# Altium schematic sheet 8CH EEG.SchDoc
size B; SheetNumber: 6; SheetTotal: 11; TitleBlk1Sch: PCBA, LUCHADOR, REV 3.2b, AMBER; TitleBlk2Sch: 8CH EEG; RevSch: 01; Eng: Haman; EngDate: 3-15-19
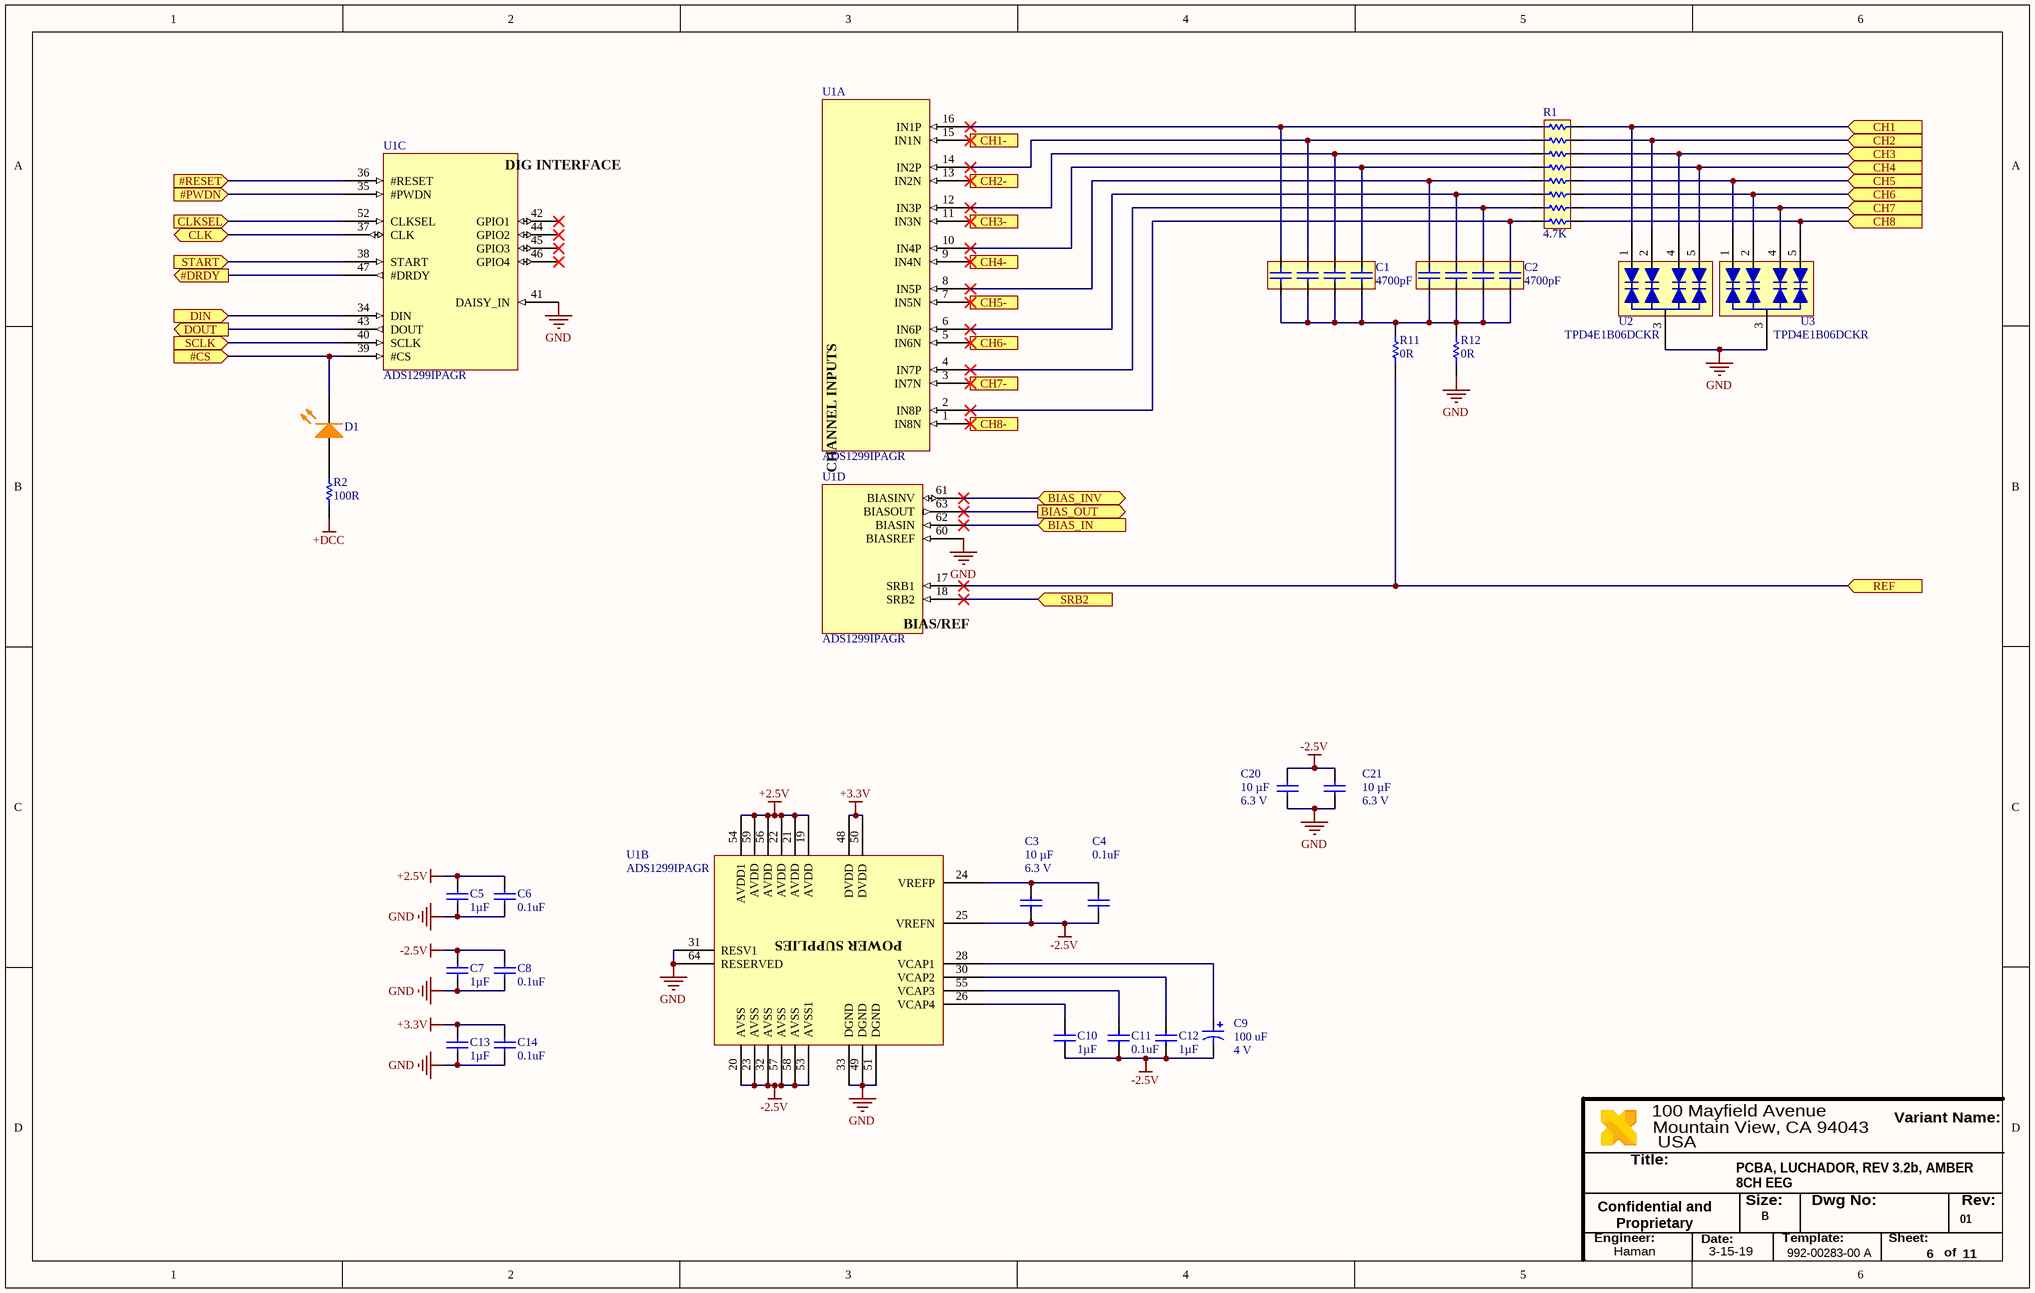
[diagram p0: 8CH EEG.SchDoc]

## Parts
C1  Capacitance: 4700pF  [1206C-ARRAY]  (hidden comment: 50V)
C2  Capacitance: 4700pF  [1206C-ARRAY]  (hidden comment: 50V)
C3  Capacitance: 10 µF  Rated Voltage: 6.3 V  [0603C]  (hidden comment: 50V)
C4  Capacitance: 0.1uF  [0402C]  (hidden comment: 50V)
C5  Capacitance: 1µF  [0402C]  (hidden comment: 50V)
C6  Capacitance: 0.1uF  [0402C]  (hidden comment: 50V)
C7  Capacitance: 1µF  [0402C]  (hidden comment: 50V)
C8  Capacitance: 0.1uF  [0402C]  (hidden comment: 50V)
C9  Capacitance: 100 uF  Voltage Rating: 4 V  [1411T]  (hidden comment: Cap Pol1)
C10  Capacitance: 1µF  [0402C]  (hidden comment: 50V)
C11  Capacitance: 0.1uF  [0402C]  (hidden comment: 50V)
C12  Capacitance: 1µF  [0402C]  (hidden comment: 50V)
C13  Capacitance: 1µF  [0402C]  (hidden comment: 50V)
C14  Capacitance: 0.1uF  [0402C]  (hidden comment: 50V)
C20  Capacitance: 10 µF  Rated Voltage: 6.3 V  [0603C]  (hidden comment: 50V)
C21  Capacitance: 10 µF  Rated Voltage: 6.3 V  [0603C]  (hidden comment: 50V)
D1  LED0_1  [0402L-ORANGE]  (value not drawn)
R1  Resistance: 4.7K  [1506R]  (hidden comment: RES 8X)
R2  Resistance: 100R  [0402R]  (hidden comment: Res 0805)
R11  Resistance (Ohms): 0R  [0402R]  (hidden comment: Res 0805)
R12  Resistance (Ohms): 0R  [0402R]  (hidden comment: Res 0805)
U1  ADS1299IPAGR  [TQFP-64]  (parts A,B,C,D of 4)
U2  TPD4E1B06DCKR  [SC70-6]
U3  TPD4E1B06DCKR  [SC70-6]

## Ports
#CS (in), #DRDY (out), #PWDN (in), #RESET (in), BIAS_IN (in), BIAS_INV (bidir), BIAS_OUT (out), CH1 (in), CH1- (in), CH2 (in), CH2- (in), CH3 (in), CH3- (in), CH4 (in), CH4- (in), CH5 (in), CH5- (in), CH6 (in), CH6- (in), CH7 (in), CH7- (in), CH8 (in), CH8- (in), CLK (bidir), CLKSEL (in), DIN (in), DOUT (out), REF (in), SCLK (in), SRB2 (in), START (in)

## Nets
+2.5V: C5.1 C6.1 U1.19(AVDD) U1.21(AVDD) U1.22(AVDD) U1.54(AVDD1) U1.56(AVDD) U1.59(AVDD)
+3.3V: C13.1 C14.1 U1.48(DVDD) U1.50(DVDD)
+DCC: R2.1
-2.5V: C3.2 C4.2 C7.1 C8.1 C9.2 C10.2 C11.2 C12.2 C20.1 C21.1 U1.20(AVSS) U1.23(AVSS) U1.25(VREFN) U1.32(AVSS) U1.53(AVSS1) U1.57(AVSS) U1.58(AVSS)
GND: C5.2 C6.2 C7.2 C8.2 C13.2 C14.2 C20.2 C21.2 R12.1 U1.31(RESV1) U1.33(DGND) U1.41(DAISY_IN) U1.49(DGND) U1.51(DGND) U1.60(BIASREF) U1.64(RESERVED) U2.3(GND) U3.3(GND)
#CS: D1.2(K) U1.39(#CS) ; port #CS
#DRDY: U1.47(#DRDY) ; port #DRDY
#PWDN: U1.35(#PWDN) ; port #PWDN
#RESET: U1.36(#RESET) ; port #RESET
BIAS_IN: U1.62(BIASIN) ; port BIAS_IN
BIAS_INV: U1.61(BIASINV) ; port BIAS_INV
BIAS_OUT: U1.63(BIASOUT) ; port BIAS_OUT
CH1: R1.B1 U2.1(IO1) ; port CH1
CH1-: U1.15(IN1N) ; port CH1-
CH2: R1.B2 U2.2(IO2) ; port CH2
CH2-: U1.13(IN2N) ; port CH2-
CH3: R1.B3 U2.4(IO3) ; port CH3
CH3-: U1.11(IN3N) ; port CH3-
CH4: R1.B4 U2.5(IO4) ; port CH4
CH4-: U1.9(IN4N) ; port CH4-
CH5: R1.B5 U3.1(IO1) ; port CH5
CH5-: U1.7(IN5N) ; port CH5-
CH6: R1.B6 U3.2(IO2) ; port CH6
CH6-: U1.5(IN6N) ; port CH6-
CH7: R1.B7 U3.4(IO3) ; port CH7
CH7-: U1.3(IN7N) ; port CH7-
CH8: R1.B8 U3.5(IO4) ; port CH8
CH8-: U1.1(IN8N) ; port CH8-
CLK: U1.37(CLK) ; port CLK
CLKSEL: U1.52(CLKSEL) ; port CLKSEL
DIN: U1.34(DIN) ; port DIN
DOUT: U1.43(DOUT) ; port DOUT
REF: R11.1 U1.17(SRB1) ; port REF
SCLK: U1.40(SCLK) ; port SCLK
SRB2: U1.18(SRB2) ; port SRB2
START: U1.38(START) ; port START
NetC1_A1: C1.A1 R1.A1 U1.16(IN1P)
NetC1_A2: C1.A2 R1.A2 U1.14(IN2P)
NetC1_A3: C1.A3 R1.A3 U1.12(IN3P)
NetC1_A4: C1.A4 R1.A4 U1.10(IN4P)
NetC1_B1: C1.B1 C1.B2 C1.B3 C1.B4 C2.B1 C2.B2 C2.B3 C2.B4 R11.2 R12.2
NetC2_A1: C2.A1 R1.A5 U1.8(IN5P)
NetC2_A2: C2.A2 R1.A6 U1.6(IN6P)
NetC2_A3: C2.A3 R1.A7 U1.4(IN7P)
NetC2_A4: C2.A4 R1.A8 U1.2(IN8P)
NetC3_1: C3.1 C4.1 U1.24(VREFP)
NetC9_1: C9.1 U1.28(VCAP1)
NetC10_1: C10.1 U1.26(VCAP4)
NetC11_1: C11.1 U1.55(VCAP3)
NetC12_1: C12.1 U1.30(VCAP2)
NetD1_1: D1.1(A) R2.2

Not connected (* = marked no-connect by the designer): U1 42(GPIO1)* 44(GPIO2)* 45(GPIO3)* 46(GPIO4)*

## Notes on the sheet
- Title:
- USA
- 100 Mayfield Avenue
- Mountain View, CA 94043
- Variant Name:
- Confidential and Proprietary
- Engineer:
- Date:
- Size:
- B
- Template:
- 992-00283-00 A
- Dwg No:
- Sheet:
- Rev:
- of
- (in symbol ADS1299IPAGR, part A) CHANNEL INPUTS
- (in symbol ADS1299IPAGR, part B) POWER SUPPLIES
- (in symbol ADS1299IPAGR, part C) DIG INTERFACE
- (in symbol ADS1299IPAGR, part D) BIAS/REF

## Library data of the parts
C1 C2 = Cap: CAP .1UF 50V CERAMIC Y5V 0805; Manufacturer: TDK; PCN Part Number: MLCC Part Number Change 30/Nov/2012; Manufacturer Part Number: CKCA43X7R1H472M100AA; Description1: Cap Ceramic Array 0.0047uF 50V X7R 20% 1206 SMD 4 Capacitor 125C Plastic T/R; Product Training Modules: CKC Series Array Capacitor Family; Catalog Drawings: CKC 1206 Series CKC 1206 Series Footprint; Featured Product: CKC Series; Tolerance: ±20%; Number of Capacitors: 4; Circuit Type: Isolated; Temperature Coefficient: X7R; Other Names: 445-1853-1; Revision: July-2002: Re-released for DXP Platform.; Supplier 1: Digi-Key; Supplier Part Number 1: 445-1853-1-ND; Stock 1: 155348; Pricing 1: 1=0.33, 10=0.228, 100=0.129, 500=0.0911, 1000=0.0797 (USD); RoHS Information: RoHS Certificate-MLCC; Standard Package: 1; Category: Capacitors; Family: Capacitor Arrays; Series: CKC; Packaging: Cut Tape (CT); Voltage - Rated: 50V; Dielectric Material: Ceramic; Mounting Type: Surface Mount; Package / Case: 1206 (3216 Metric); Size / Dimension: 0.126" L x 0.063" W (3.20mm x 1.60mm); Height - Seated (Max): 0.051" (1.30mm); Ratings: -; Online Catalog: CKC Series; ComponentLink1URL: https://datasheet.ciiva.com/7615/mlccspec-commercial-array-en-7615142.pdf; ComponentLink1Description: https://datasheet.ciiva.com/7615/mlccspec-commercial-array-en-7615142.pdf; ComponentLink2URL: https://datasheet.ciiva.com/7615/mlccspec-commercial-array-en-7615147.pdf; ComponentLink2Description: https://datasheet.ciiva.com/7615/mlccspec-commercial-array-en-7615147.pdf; ComponentLink3URL: https://datasheet.ciiva.com/7615/mlccspec-commercial-array-en-7615148.pdf; ComponentLink3Description: https://datasheet.ciiva.com/7615/mlccspec-commercial-array-en-7615148.pdf; ComponentLink4URL: https://datasheet.ciiva.com/24216/ckca43x7r1h472m100aa-266209-24216735.pdf; ComponentLink4Description: https://datasheet.ciiva.com/24216/ckca43x7r1h472m100aa-266209-24216735.pdf
C3 C20 C21 = Cap: CAP .1UF 50V CERAMIC Y5V 0805; Manufacturer: Samsung; Manufacturer Part Number: CL10B106MQ8NRNC; Description1: 10µF ±20% 6.3V X7R Ceramic Capacitor -55°C ~ 125°C Surface Mount, MLCC 0603 (1608 Metric) 0.063" L x 0.031" W (1.60mm x 0.80mm); Dielectric: X7R; Tolerance (%): ±20 %; Revision: July-2002: Re-released for DXP Platform.; Supplier 1: Digi-Key; Supplier Part Number 1: 1276-1948-1-ND; Stock 1: 40000; Pricing 1: 1=1.07, 10=0.813, 100=0.5813, 500=0.45, 1000=0.3875 (USD); Case Size/Dimension: 0603; ComponentLink1URL: https://datasheet.ciiva.com/25723/cl10b106mq8nrnc-25723233.pdf; ComponentLink1Description: https://datasheet.ciiva.com/25723/cl10b106mq8nrnc-25723233.pdf; ComponentLink2URL: https://datasheet.ciiva.com/16428/cl10b106mq8nrnc-16428858.pdf; ComponentLink2Description: https://datasheet.ciiva.com/16428/cl10b106mq8nrnc-16428858.pdf
C4 C6 C8 C11 C14 = Cap: CAP .1UF 50V CERAMIC Y5V 0805; Manufacturer: Kyocera AVX; Manufacturer Part Number: 0402YD104KAT2A; Description1: AVX   0402YD104KAT2A   Multilayer Ceramic Capacitor, 0.1 F,  10%, X5R, 16 V, 0402 [1005 Metric]; Dielectric: X5R; Tolerance (%): ±10 %; Rated Voltage: 16 V; Revision: July-2002: Re-released for DXP Platform.; Supplier 1: Digi-Key; Supplier Part Number 1: 478-1126-1-ND; Stock 1: 0; Pricing 1: 1=0.1, 10=0.047, 100=0.0211, 500=0.0151, 1000=0.0119, 2500=0.0108, 5000=0.0099 (USD); Case Size/Dimension: 0402; ComponentLink1URL: https://datasheet.ciiva.com/2987/cx5r-2987712.pdf; ComponentLink1Description: https://datasheet.ciiva.com/2987/cx5r-2987712.pdf; ComponentLink2URL: https://datasheet.ciiva.com/150/cx5r-150353.pdf; ComponentLink2Description: https://datasheet.ciiva.com/150/cx5r-150353.pdf; ComponentLink3URL: https://datasheet.ciiva.com/150/cx5r-150354.pdf; ComponentLink3Description: https://datasheet.ciiva.com/150/cx5r-150354.pdf; ComponentLink4URL: https://datasheet.ciiva.com/11786/0900766b80def1a5-11786866.pdf; ComponentLink4Description: https://datasheet.ciiva.com/11786/0900766b80def1a5-11786866.pdf; ComponentLink5URL: https://datasheet.ciiva.com/150/cx5r-150355.pdf; ComponentLink5Description: https://datasheet.ciiva.com/150/cx5r-150355.pdf; ComponentLink6URL: https://datasheet.ciiva.com/1124/1666675-1124009.pdf; ComponentLink6Description: https://datasheet.ciiva.com/1124/1666675-1124009.pdf; ComponentLink7URL: https://datasheet.ciiva.com/5423/cx5r-33896-5423625.pdf; ComponentLink7Description: https://datasheet.ciiva.com/5423/cx5r-33896-5423625.pdf; ComponentLink8URL: https://datasheet.ciiva.com/1124/1666675-1124010.pdf; ComponentLink8Description: https://datasheet.ciiva.com/1124/1666675-1124010.pdf; ComponentLink9URL: https://datasheet.ciiva.com/14590/70001028-14590205.pdf; ComponentLink9Description: https://datasheet.ciiva.com/14590/70001028-14590205.pdf; ComponentLink10URL: https://datasheet.ciiva.com/14592/70001028-14592157.pdf; ComponentLink10Description: https://datasheet.ciiva.com/14592/70001028-14592157.pdf; ComponentLink11URL: https://datasheet.ciiva.com/16623/cx5r-16623293.pdf; ComponentLink11Description: https://datasheet.ciiva.com/16623/cx5r-16623293.pdf; ComponentLink12URL: https://datasheet.ciiva.com/34303/1928960-34303277.pdf; ComponentLink12Description: https://datasheet.ciiva.com/34303/1928960-34303277.pdf; ComponentLink13URL: https://datasheet.ciiva.com/2987/cx5r-2987711.pdf; ComponentLink13Description: https://datasheet.ciiva.com/2987/cx5r-2987711.pdf
C5 C7 C10 C12 C13 = Cap: CAP .1UF 50V CERAMIC Y5V 0805; Manufacturer: TDK; Manufacturer Part Number: CGB2A1JB1C105K033BC; PCN Part Number: MLCC Part Number Change 30/Nov/2012; Description1: 1µF ±10% 16V JB Ceramic Capacitor -25°C ~ 85°C Surface Mount, MLCC 0402 (1005 Metric) 0.039" L x 0.020" W (1.00mm x 0.50mm); Product Training Modules: SEAT, CCV, and TVCL Design Tools Guide to Replacing an Electrolytic Capacitor with an MLCC; Featured Product: CGB Series Capacitors CH and JB Temperature Coefficient Capacitors; EDA / CAD Models: Download from Accelerated Designs; Tolerance: ±10%; Voltage - Rated: 16V; Temperature Coefficient: JB; Online Catalog: CGB Series; Other Names: 445-12011-6; Revision: July-2002: Re-released for DXP Platform.; Supplier 1: Digi-Key; Supplier Part Number 1: 445-12011-1-ND; Stock 1: 7430; Pricing 1: 1=0.22, 10=0.151, 100=0.0765, 500=0.0523, 1000=0.0463, 2500=0.0443, 5000=0.0403 (USD); RoHS Information: RoHS Certificate-MLCC; Standard Package: 1; Category: Capacitors; Family: Ceramic Capacitors; Series: CGB; Packaging: Digi-Reel®; Mounting Type: Surface Mount, MLCC; Operating Temperature: -25°C ~ 85°C; Applications: General Purpose; Package / Case: 0402 (1005 Metric); Size / Dimension: 0.039" L x 0.020" W (1.00mm x 0.50mm); Thickness (Max): 0.013" (0.33mm); Features: Low Profile; ComponentLink1URL: https://product.tdk.com/info/en/catalog/datasheets/mlcc_commercial_lowprofile_en.pdf; ComponentLink1Description: https://product.tdk.com/info/en/catalog/datasheets/mlcc_commercial_lowprofile_en.pdf; ComponentLink2URL: https://product.tdk.com/info/en/catalog/spec/mlccspec_commercial_lowprofile_en.pdf; ComponentLink2Description: https://product.tdk.com/info/en/catalog/spec/mlccspec_commercial_lowprofile_en.pdf; ComponentLink3URL: http://product.tdk.com/en/catalog/datasheets/mlcc_commercial_lowprofile_en.pdf; ComponentLink3Description: http://product.tdk.com/en/catalog/datasheets/mlcc_commercial_lowprofile_en.pdf
C9 = Cap Pol1: Polarized Capacitor (Radial); Manufacturer: KEMET; Manufacturer Part Number: T520T107M004ATE070; Mfr Case Code: T Case; Description1: CAP TANT POLY 100UF 4V 1411; Tolerance: 20 %; ESR: 70 mOhms; Case Length: 3.5 mm; Case Width: 2.8 mm; Type: Conductive Polymer Chip Capacitors; Supplier 1: Digi-Key; Supplier Part Number 1: 399-5289-1-ND; Stock 1: 31834; Pricing 1: 1=1.61, 10=1.268, 100=0.9509, 500=0.7185, 1000=0.6339 (USD); Dimensions: 2.8 mm W x 3.5 mm L; Product Category: Tantalum Capacitors - Polymer SMD; RoHS: Details; Brand: Kemet; Case Code - in: 1411; Case Code - mm: 6032; Height: 1.2 mm; Operating Temperature Range: - 55 C to + 105 C; Package / Case: 1411 (3528 metric); Packaging: Reel; Product: Tantalum Organic Polymer Low ESR; Series: T520, PSL; Factory Pack Quantity: 2500; Termination Style: SMD/SMT; Tradename: KO-CAP; Voltage Rating DC: 4 V; ComponentLink1URL: https://datasheet.ciiva.com/260/kem-t2015-t520-260217.pdf; ComponentLink1Description: https://datasheet.ciiva.com/260/kem-t2015-t520-260217.pdf; ComponentLink2URL: https://datasheet.ciiva.com/260/kem-t2015-t520-260218.pdf; ComponentLink2Description: https://datasheet.ciiva.com/260/kem-t2015-t520-260218.pdf; ComponentLink3URL: https://datasheet.ciiva.com/260/kem-t2015-t520-260219.pdf; ComponentLink3Description: https://datasheet.ciiva.com/260/kem-t2015-t520-260219.pdf
D1 = LED0_1: Typical INFRARED GaAs LED; Manufacturer: Vishay; Manufacturer Part Number: VLMO1500-GS08; Description1: Standard LEDs - SMD 0402 SOFT ORANGE Non-Diff; Illumination Color: Orange; Wavelength/Color Temperature: 605 nm; Luminous Intensity: 90 mcd; Viewing Angle: 130 deg; Lens Color/Style: Water Clear; If - Forward Current: 30 mA; Vf - Forward Voltage: 2 V; Power Rating: 75 mW; Brand: Vishay Semiconductors; Supplier 1: Digi-Key; Supplier Part Number 1: VLMO1500-GS08CT-ND; Stock 1: 194938; Pricing 1: 1=0.53, 10=0.38, 25=0.2916, 100=0.1901, 250=0.1394, 500=0.1183, 1000=0.0972 (USD); Product Category: Standard LEDs - SMD; RoHS: True; Package / Case: 0402 (1005 metric); Length: 1 mm; Height: 0.35 mm; Width: 0.5 mm; Minimum Operating Temperature: - 30 C; Maximum Operating Temperature: + 85 C; Series: VLMx; Packaging: Reel; Mounting Style: SMD/SMT; Factory Pack Quantity: 9000; Tradename: ChipLED; ComponentLink1URL: https://datasheet.ciiva.com/13945/vlmo1500-13945355.pdf; ComponentLink1Description: https://datasheet.ciiva.com/13945/vlmo1500-13945355.pdf; ComponentLink2URL: https://datasheet.ciiva.com/13945/vlmo1500-13945356.pdf; ComponentLink2Description: https://datasheet.ciiva.com/13945/vlmo1500-13945356.pdf; ComponentLink3URL: https://datasheet.ciiva.com/13945/vlmo1500-13945357.pdf; ComponentLink3Description: https://datasheet.ciiva.com/13945/vlmo1500-13945357.pdf
R1 = RES 8X: Resistor; Manufacturer: Panasonic; Manufacturer Part Number: EXB-2HV472JV; Description1: Res Thick Film Array 4.7K Ohm 5% 1/4W ±200ppm/°C ISOL 16-Pin 1506(8 X 0402) Convex SMD Punched Carrier T/R; No of Elements: 8; Tolerance (%): ±5 %; Power Dissipation: 0.063 W; Voltage Rating: 50 V; Supplier 1: Digi-Key; Supplier Part Number 1: Y1472CT-ND; Stock 1: 49295; Pricing 1: 1=0.29, 10=0.248, 25=0.1804, 50=0.1308, 100=0.097, 250=0.0744, 500=0.0586, 1000=0.0406 (USD); Case Size: 0402 (1005 Metric); ComponentLink1URL: https://datasheet.ciiva.com/19466/1387876-19466987.pdf; ComponentLink1Description: https://datasheet.ciiva.com/19466/1387876-19466987.pdf; ComponentLink2URL: https://datasheet.ciiva.com/28636/1790599-28636958.pdf; ComponentLink2Description: https://datasheet.ciiva.com/28636/1790599-28636958.pdf; ComponentLink3URL: https://datasheet.ciiva.com/30089/aoc0000ce1-30089086.pdf; ComponentLink3Description: https://datasheet.ciiva.com/30089/aoc0000ce1-30089086.pdf
R2 = Res 0805: Resistor; Manufacturer: Panasonic; Manufacturer Part Number: ERJ-2RKF1000X; Description1: Res Thick Film 0402 100 Ohm 1% 0.1W(1/10W) ±100ppm/C Molded SMD Automotive T/R; Rated Power: 0.1 W; Tolerance (%): ±1 %; Temp Coefficient: ±100 ppm/°C; Supplier 1: Digi-Key; Supplier Part Number 1: P100LCT-ND; Stock 1: 14075966; Pricing 1: 1=0.1, 10=0.056, 100=0.0227, 1000=0.0102, 2500=0.0089, 5000=0.0073 (USD); Size Code: 0402; ComponentLink1URL: https://datasheet.ciiva.com/27056/2007311-27056035.pdf; ComponentLink1Description: https://datasheet.ciiva.com/27056/2007311-27056035.pdf; ComponentLink2URL: https://datasheet.ciiva.com/11821/0900766b80f80784-11821173.pdf; ComponentLink2Description: https://datasheet.ciiva.com/11821/0900766b80f80784-11821173.pdf; ComponentLink3URL: https://datasheet.ciiva.com/46372/1678782-46372741.pdf; ComponentLink3Description: https://datasheet.ciiva.com/46372/1678782-46372741.pdf; ComponentLink4URL: https://datasheet.ciiva.com/16199/aoa0000ce2-16199575.pdf; ComponentLink4Description: https://datasheet.ciiva.com/16199/aoa0000ce2-16199575.pdf; ComponentLink5URL: https://datasheet.ciiva.com/43467/1678782-43467223.pdf; ComponentLink5Description: https://datasheet.ciiva.com/43467/1678782-43467223.pdf; ComponentLink6URL: https://datasheet.ciiva.com/30260/aoa0000ce2-30260809.pdf; ComponentLink6Description: https://datasheet.ciiva.com/30260/aoa0000ce2-30260809.pdf; ComponentLink7URL: https://datasheet.ciiva.com/9186/aoa0000ce2-9186683.pdf; ComponentLink7Description: https://datasheet.ciiva.com/9186/aoa0000ce2-9186683.pdf; ComponentLink8URL: https://datasheet.ciiva.com/16776/70260748-16776427.pdf; ComponentLink8Description: https://datasheet.ciiva.com/16776/70260748-16776427.pdf; ComponentLink9URL: https://datasheet.ciiva.com/48531/aoa0000ce2-48531067.pdf; ComponentLink9Description: https://datasheet.ciiva.com/48531/aoa0000ce2-48531067.pdf; ComponentLink10URL: https://datasheet.ciiva.com/17207/aoa0000ce2-17207980.pdf; ComponentLink10Description: https://datasheet.ciiva.com/17207/aoa0000ce2-17207980.pdf; ComponentLink11URL: https://datasheet.ciiva.com/7830/426256-7830973.pdf; ComponentLink11Description: https://datasheet.ciiva.com/7830/426256-7830973.pdf; ComponentLink12URL: https://datasheet.ciiva.com/16522/aoa0000ce2-16522621.pdf; ComponentLink12Description: https://datasheet.ciiva.com/16522/aoa0000ce2-16522621.pdf; ComponentLink13URL: https://datasheet.ciiva.com/28514/1678782-28514175.pdf; ComponentLink13Description: https://datasheet.ciiva.com/28514/1678782-28514175.pdf
R11 R12 = Res 0805: Resistor; Manufacturer: Panasonic; Manufacturer Part Number: ERJ-2GE0R00X; Description1: Res Thick Film 0402 0 Ohm Molded SMD Automotive T/R; EDA / CAD Models: Download from Accelerated Designs; Tolerance: Jumper; Power (Watts): 0.1W, 1/10W; Online Catalog: ERJ Series; Other Names: P0.0JDKR; Supplier 1: Digi-Key; Supplier Part Number 1: P0.0JCT-ND; Stock 1: 31263960; Pricing 1: 1=0.1, 10=0.037, 25=0.0268, 50=0.0204, 100=0.015, 250=0.0114, 500=0.0091, 1000=0.0067, 5000=0.0048 (USD); Standard Package: 1; Category: Resistors; Family: Chip Resistor - Surface Mount; Series: ERJ; Packaging: Digi-Reel®; Composition: Thick Film; Features: Automotive AEC-Q200; Temperature Coefficient: -; Operating Temperature: -55°C ~ 155°C; Package / Case: 0402 (1005 Metric); Supplier Device Package: 0402; Size / Dimension: 0.039" L x 0.020" W (1.00mm x 0.50mm); Height: 0.016" (0.40mm); Number of Terminations: 2; ComponentLink1URL: https://datasheet.ciiva.com/48531/aoa0000ce1-48531077.pdf; ComponentLink1Description: https://datasheet.ciiva.com/48531/aoa0000ce1-48531077.pdf; ComponentLink2URL: https://datasheet.ciiva.com/16783/70260739-16783734.pdf; ComponentLink2Description: https://datasheet.ciiva.com/16783/70260739-16783734.pdf; ComponentLink3URL: https://datasheet.ciiva.com/11821/0900766b80f806dd-11821176.pdf; ComponentLink3Description: https://datasheet.ciiva.com/11821/0900766b80f806dd-11821176.pdf; ComponentLink4URL: https://datasheet.ciiva.com/17215/aoa0000ce1-17215386.pdf; ComponentLink4Description: https://datasheet.ciiva.com/17215/aoa0000ce1-17215386.pdf; ComponentLink5URL: https://datasheet.ciiva.com/43460/1678796-43460347.pdf; ComponentLink5Description: https://datasheet.ciiva.com/43460/1678796-43460347.pdf; ComponentLink6URL: https://datasheet.ciiva.com/5959/1678796-5959692.pdf; ComponentLink6Description: https://datasheet.ciiva.com/5959/1678796-5959692.pdf; ComponentLink7URL: https://datasheet.ciiva.com/30097/4aoa0000ce1-30097116.pdf; ComponentLink7Description: https://datasheet.ciiva.com/30097/4aoa0000ce1-30097116.pdf; ComponentLink8URL: https://datasheet.ciiva.com/28695/1678796-28695758.pdf; ComponentLink8Description: https://datasheet.ciiva.com/28695/1678796-28695758.pdf; ComponentLink9URL: https://datasheet.ciiva.com/46389/1678796-46389518.pdf; ComponentLink9Description: https://datasheet.ciiva.com/46389/1678796-46389518.pdf; ComponentLink10URL: https://datasheet.ciiva.com/16778/70260739-16778335.pdf; ComponentLink10Description: https://datasheet.ciiva.com/16778/70260739-16778335.pdf
U1 = ADS1299IPAGR: Manufacturer: Texas Instruments; Description1: IC AFE 24BIT 16KSPS LN 64TQFP; Number of Bits: 24; Number of Channels: 8; Power (Watts): 42mW; Voltage - Supply, Analog: 5V; Voltage - Supply, Digital: 1.8 V ~ 3.6 V; Supplier 1: Digi-Key; Supplier Part Number 1: 296-34818-1-ND; RoHS: RoHS Compliant; Category: Integrated Circuits (ICs); Stock 1: 1324; Pricing 1: 1=55.08, 10=51.84, 100=46.332, 500=43.416, 1000=40.5 (USD); Packaging: Cut Tape (CT); Part Status: Active; Package / Case: 64-TQFP; Supplier Device Package: 64-TQFP (10x10); ComponentLink1URL: http://www.ti.com/lit/ds/symlink/ads1299.pdf; ComponentLink1Description: http://www.ti.com/lit/ds/symlink/ads1299.pdf; Manufacturer Part Number: ADS1299IPAGR
U2 U3 = TPD4E1B06DCKR: Manufacturer: Texas Instruments; Description1: TVS DIODE 5.5VWM 14.5VC SC70-6; Direction Type: Uni-Directional; Maximum Clamping Voltage: 15(Typ) V; Number of Elements per Chip: 4; ESD Protection Voltage: ±18@Air Gap/±18@Contact Disc kV; Maximum Working Voltage: 5.5 V; Maximum Leakage Current: 0.01 uA; Capacitance Value: 1 pF; Supplier 1: Digi-Key; Supplier Part Number 1: 296-39346-1-ND; Stock 1: 120901; Pricing 1: 1=0.61, 10=0.519, 100=0.3876, 500=0.3046, 1000=0.2353 (USD); Type: Diode Arrays; Pin Count: 6; Minimum Operating Temperature: -40 °C; Maximum Operating Temperature: 125 °C; Mounting: Surface Mount; Category: ESD Suppressors; ComponentLink1URL: https://datasheet.ciiva.com/12545/tpd4e1b06-224687-12545147.pdf; ComponentLink1Description: https://datasheet.ciiva.com/12545/tpd4e1b06-224687-12545147.pdf; ComponentLink2URL: https://datasheet.ciiva.com/6574/tpd4e1b06-6574671.pdf; ComponentLink2Description: https://datasheet.ciiva.com/6574/tpd4e1b06-6574671.pdf; Manufacturer Part Number: TPD4E1B06DCKR